# EAGLE design server (EAGLE 9.0.1)
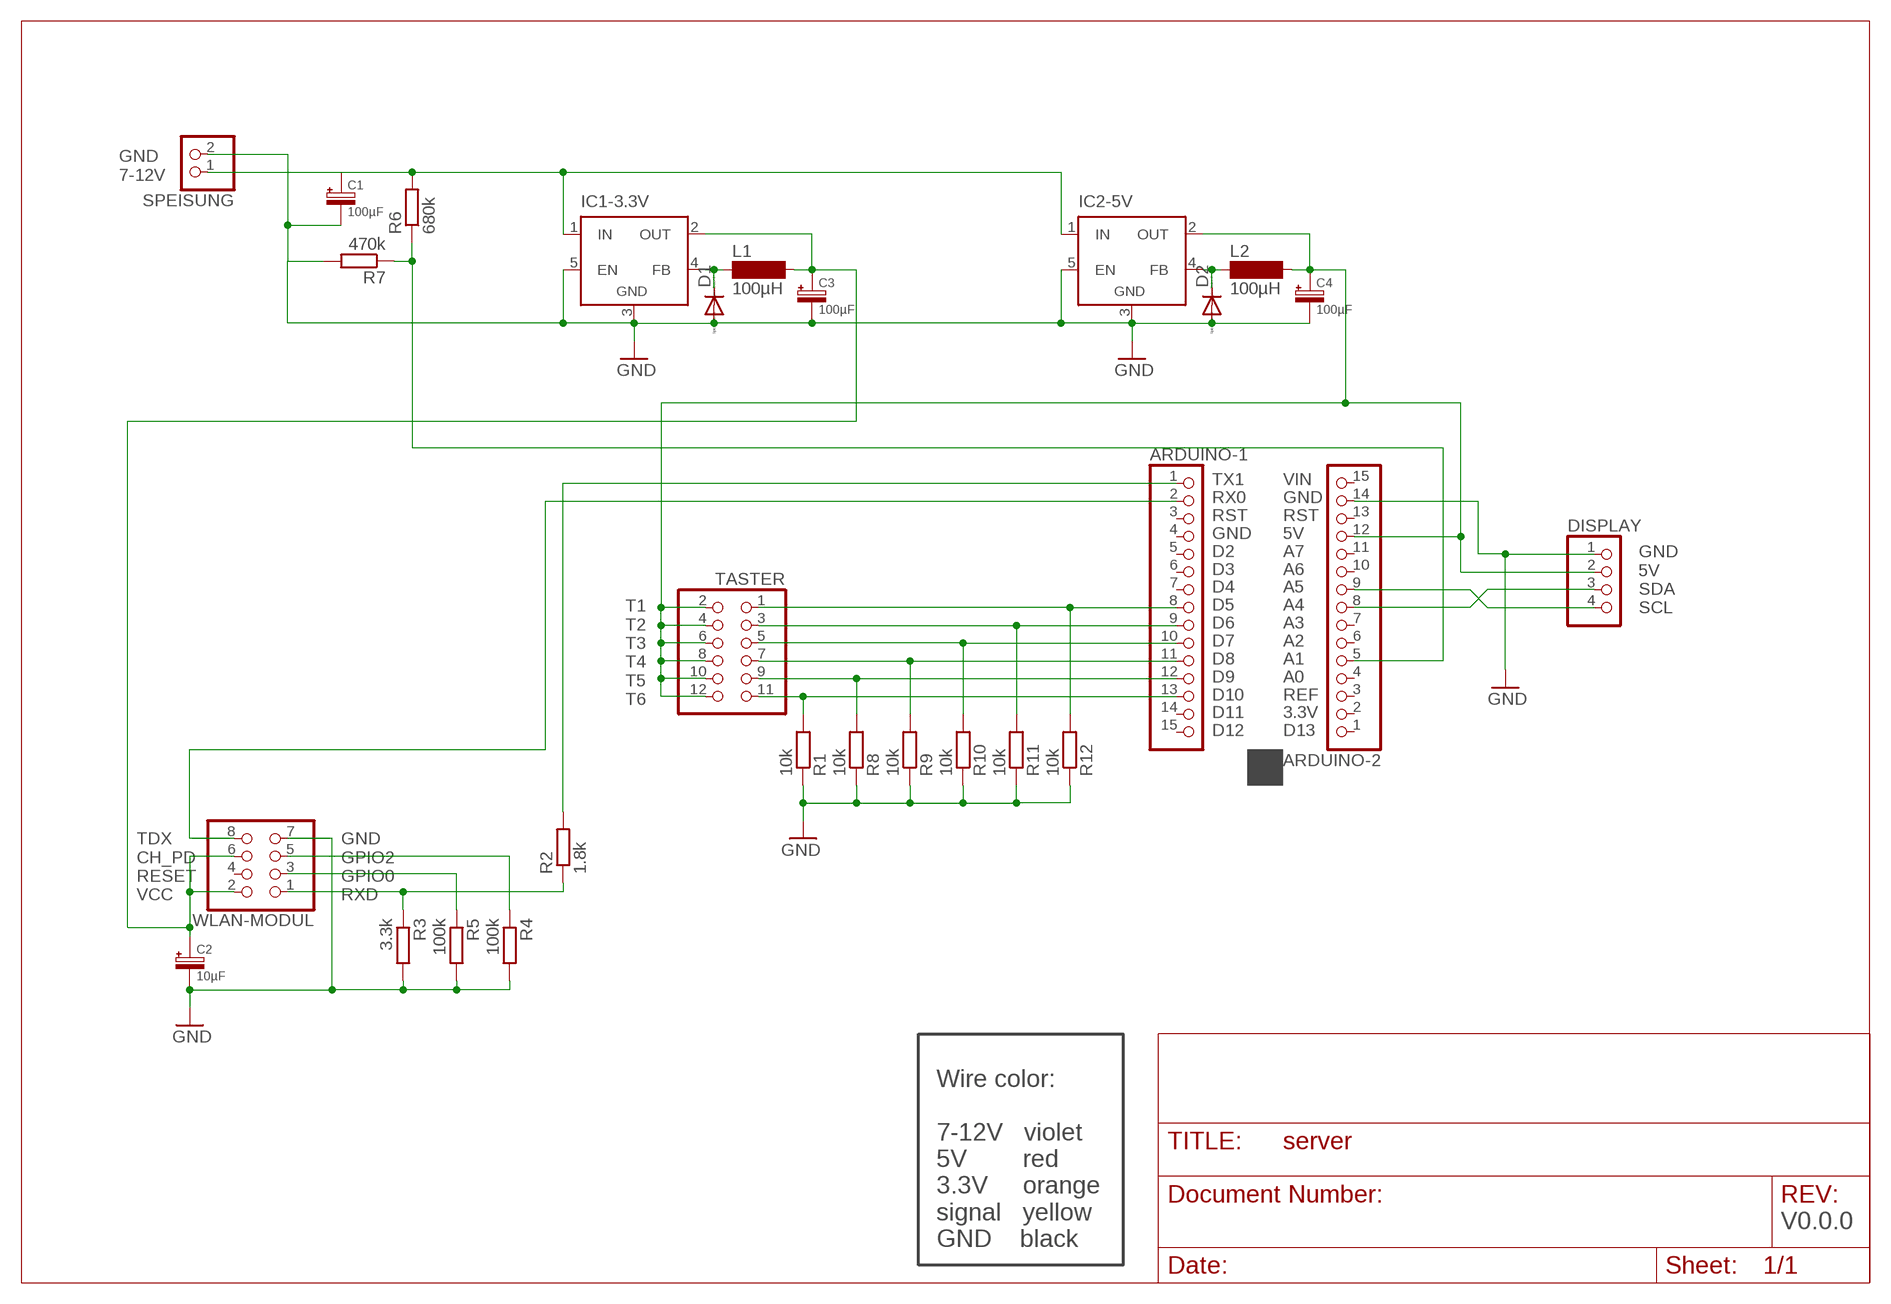
[diagram p0: schematic, sheet 1]

## Parts
ARDUINO-1  PINHD-1X15  [1X15]
ARDUINO-2  PINHD-1X15  [1X15]
C1  100µF  KONDENSATOR_ELEKTROLYT  [KONDENSATOR_ELEKTROLYT]
C2  10µF  KONDENSATOR_ELEKTROLYT  [KONDENSATOR_ELEKTROLYT]
C3  100µF  KONDENSATOR_ELEKTROLYT  [KONDENSATOR_ELEKTROLYT]
C4  100µF  KONDENSATOR_ELEKTROLYT  [KONDENSATOR_ELEKTROLYT]
D1  DIODE-D-2.5  [D-2.5]
D2  DIODE-D-2.5  [D-2.5]
DISPLAY  PINHD-1X4  [1X04]
IC1-3.3V  LM2596TV  [TO220-51]
IC2-5V  LM2596TV  [TO220-51]
L1  100µH  SM-L15A  [SM-L15A]
L2  100µH  SM-L15A  [SM-L15A]
R1  10k  R-EU_0207/15  [0207/15]
R2  1.8k  R-EU_0207/10  [0207/10]
R3  3.3k  R-EU_0207/10  [0207/10]
R4  100k  R-EU_0207/10  [0207/10]
R5  100k  R-EU_0207/10  [0207/10]
R6  680k  R-EU_0204/2V  [0204V]
R7  470k  R-EU_0204/2V  [0204V]
R8  10k  R-EU_0207/12  [0207/12]
R9  10k  R-EU_0207/10  [0207/10]
R10  10k  R-EU_0207/7  [0207/7]
R11  10k  R-EU_0207/5V  [0207/5V]
R12  10k  R-EU_0207/2V  [0207/2V]
SPEISUNG  PINHD-1X2  [1X02]
TASTER  PINHD-2X6  [2X06]
WLAN-MODUL  PINHD-2X4  [2X04]

## Nets
GND: ARDUINO-2.14 C1.P$1 C2.P$1 C3.P$1 C4.P$1 D1.A D2.A DISPLAY.1 IC1-3.3V.3(GND) IC1-3.3V.5(EN) IC2-5V.3(GND) IC2-5V.5(EN) R1.1 R3.2 R4.2 R5.2 R7.2 R8.1 R9.1 R10.1 R11.1 R12.1 SPEISUNG.2 WLAN-MODUL.7
N$1: D1.C IC1-3.3V.4(FB) L1.1
N$2: ARDUINO-1.9 R11.2 TASTER.3
N$3: C1.P$2 IC1-3.3V.1(IN) IC2-5V.1(IN) R6.2 SPEISUNG.1
N$4: C2.P$2 C3.P$2 IC1-3.3V.2(OUT) L1.2 WLAN-MODUL.2 WLAN-MODUL.6
N$5: D2.C IC2-5V.4(FB) L2.1
N$6: ARDUINO-1.13 R1.2 TASTER.11
N$7: ARDUINO-2.5 R6.1 R7.1
N$8: ARDUINO-2.8 DISPLAY.3
N$9: ARDUINO-1.12 R8.2 TASTER.9
N$10: ARDUINO-2.9 DISPLAY.4
N$11: R2.1 R3.1 WLAN-MODUL.1
N$12: R5.1 WLAN-MODUL.3
N$13: R4.1 WLAN-MODUL.5
N$14: ARDUINO-1.1 R2.2
N$15: ARDUINO-1.2 WLAN-MODUL.8
N$16: ARDUINO-1.11 R9.2 TASTER.7
N$17: ARDUINO-1.10 R10.2 TASTER.5
N$18: ARDUINO-2.12 C4.P$2 DISPLAY.2 IC2-5V.2(OUT) L2.2 TASTER.2 TASTER.4 TASTER.6 TASTER.8 TASTER.10 TASTER.12
N$19: ARDUINO-1.8 R12.2 TASTER.1
Unconnected: ARDUINO-1.3 ARDUINO-1.4 ARDUINO-1.5 ARDUINO-1.6 ARDUINO-1.7 ARDUINO-1.14 ARDUINO-1.15 ARDUINO-2.1 ARDUINO-2.2 ARDUINO-2.3 ARDUINO-2.4 ARDUINO-2.6 ARDUINO-2.7 ARDUINO-2.10 ARDUINO-2.11 ARDUINO-2.13 ARDUINO-2.15 WLAN-MODUL.4

## Notes on the sheet
- GND
  7-12V
- GND
  5V
  SDA
  SCL
- T1
  T2
  T3
  T4
  T5
  T6
- TX1
  RX0
  RST
  GND
  D2
  D3
  D4
  D5
  D6
  D7
  D8
  D9
  D10
  D11
  D12
- VIN
  GND
  RST
  5V
  A7
  A6
  A5
  A4
  A3
  A2
  A1
  A0
  REF
  3.3V
  D13
- TDX
  CH_PD
  RESET
  VCC
- GND
  GPIO2
  GPIO0
  RXD
- V0.0.0
- Wire color:
  
  7-12V   violet
  5V        red
  3.3V     orange
  signal   yellow
  GND    black

## Library data of the parts
ARDUINO-1 ARDUINO-2 = pinhead:PINHD-1X15: PIN HEADER
C1-C4 = 0_TEC-1.IPA Sven:KONDENSATOR_ELEKTROLYT
D1 D2 = diode:DIODE-: DIODE
DISPLAY = pinhead:PINHD-1X4: PIN HEADER
IC1-3.3V IC2-5V = linear:LM2596T: STEP-DOWN VOLTAGE REGULATOR
L1 L2 = inductor-neosid:SM-L15: INDUCTOR SMD air coil with pick and place cap; OC_FARNELL: unknown; OC_NEWARK: unknown
R1 R6-R12 = rcl:R-EU_: RESISTOR, European symbol; SPICEPREFIX: R
R2-R5 = rcl:R-EU_: RESISTOR, European symbol
SPEISUNG = pinhead:PINHD-1X2: PIN HEADER
TASTER = pinhead:PINHD-2X6: PIN HEADER
WLAN-MODUL = pinhead:PINHD-2X4: PIN HEADER

## Board
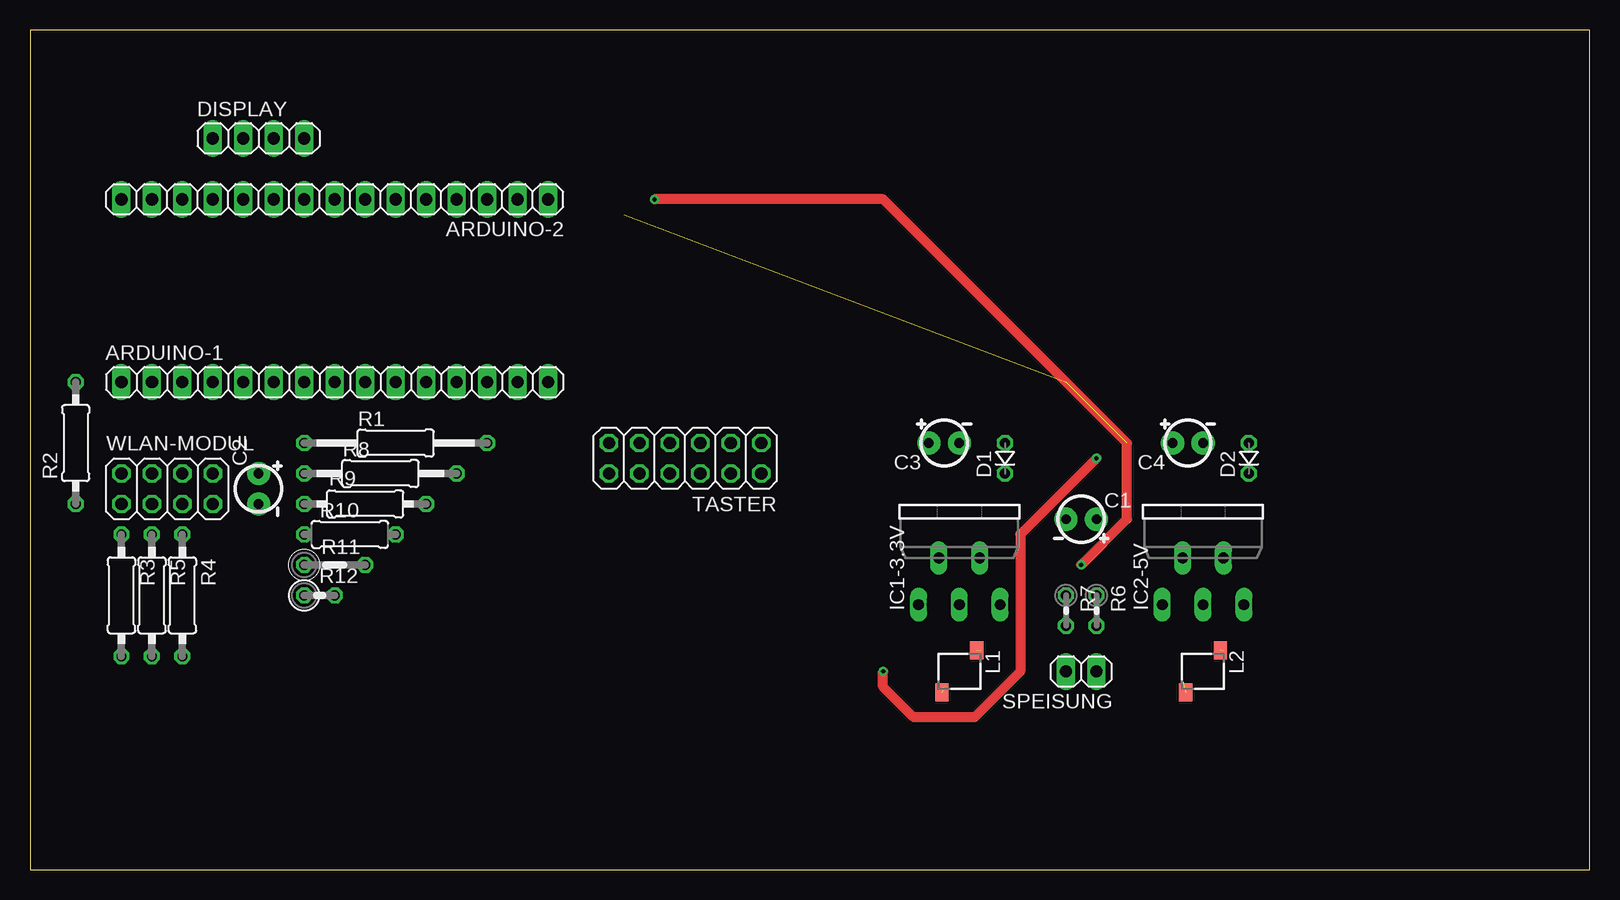
[diagram p1: board, top side]
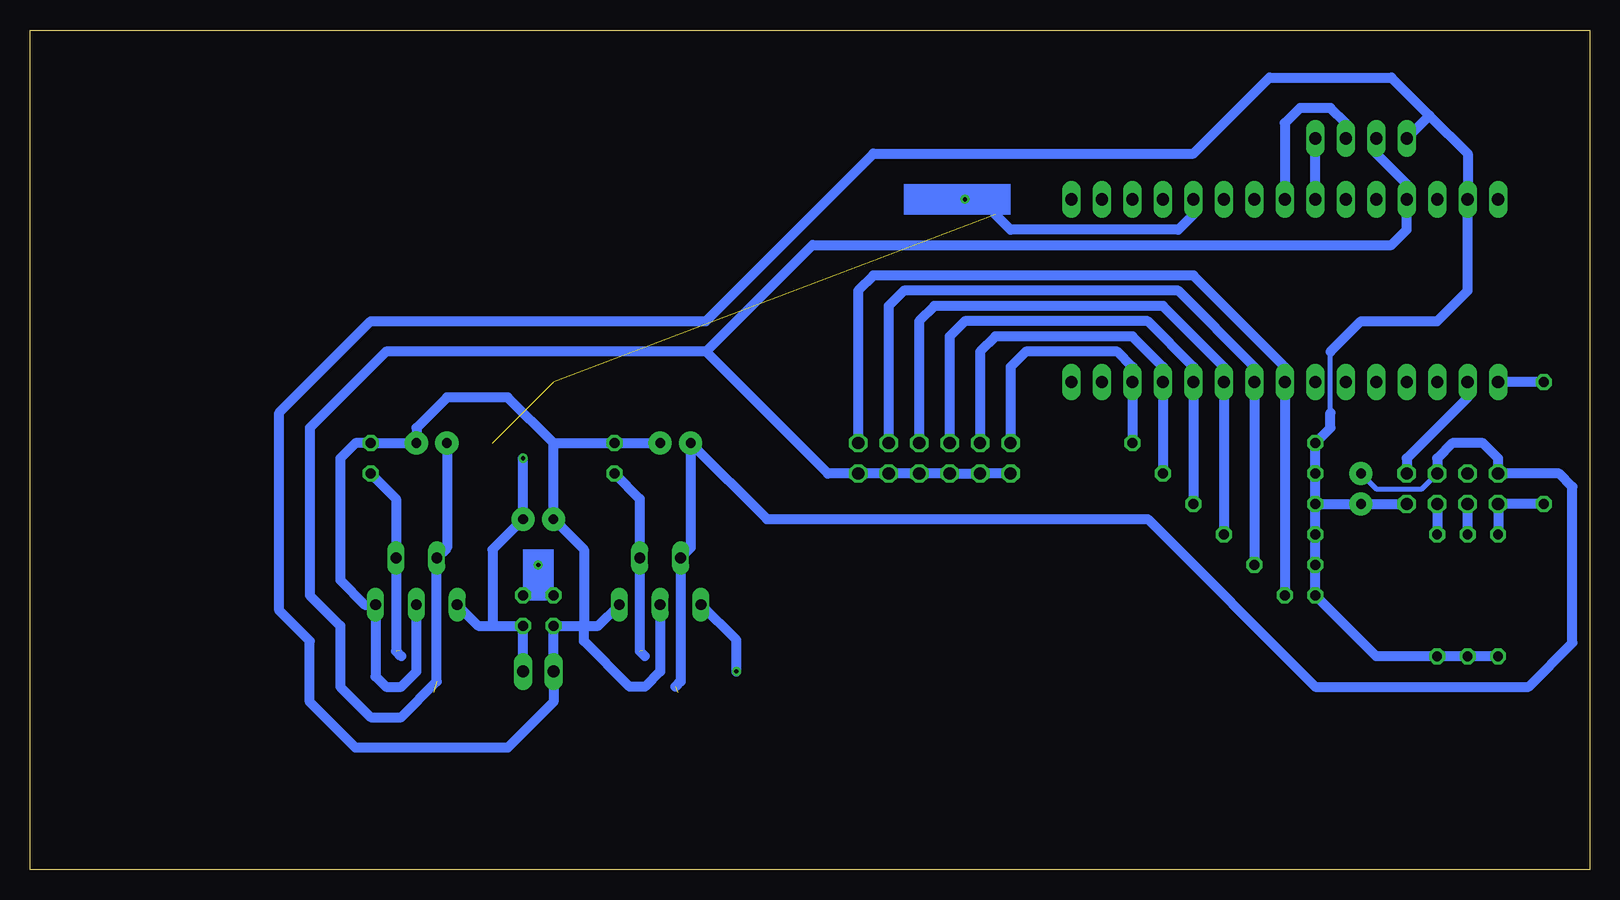
[diagram p2: board, bottom side, seen from below]

Size 130 x 70 mm. Coordinates in mm from the lower left corner, seen from the top.
Outline: 0,0 130,0 130,70 0,70 0,0
Copper layers (1*16): Top 0.035mm / dielectric 1.5mm / Bottom 0.035mm
Design rules "default": minimum track width 6mil, minimum drill 0.35mm, track to track 6mil, track to pad 6mil, pad to pad 6mil, via to via 6mil, smd to smd 6mil, copper to edge 40mil, drill to drill 6mil, minimum pad ring 10mil, minimum via ring 8mil, stop-mask expansion 4mil, vias tented up to drill 0mil, thermal gap 10mil

### Footprints (pad centres in the part's own frame; a part is rotated, then mirrored left to right if it is on the bottom)
1X15 = drill 1.016 long: 1 -17.78,0; 2 -15.24,0; 3 -12.7,0; 4 -10.16,0; 5 -7.62,0; 6 -5.08,0; 7 -2.54,0; 8 0,0; 9 2.54,0; 10 5.08,0; 11 7.62,0; 12 10.16,0; 13 12.7,0; 14 15.24,0; 15 17.78,0
KONDENSATOR_ELEKTROLYT = drill 0.8 pad 1.93: P$1 -1.27,0; P$2 1.27,0
D-2.5 = drill 0.813 octagon: A 1.27,0; C -1.27,0
1X04 = drill 1.016 long: 1 -3.81,0; 2 -1.27,0; 3 1.27,0; 4 3.81,0
TO220-51 = drill 0.9 long: 1 -3.4,-8.4; 2 -1.7,-4.5; 3 0,-8.4; 4 1.7,-4.5; 5 3.4,-8.4
SM-L15A = smd 1.1 x 1.5: 1 -1.45,-1.75; 2 1.45,1.75
0207/15 = drill 0.813 octagon: 1 -7.62,0; 2 7.62,0
0207/10 = drill 0.813 octagon: 1 -5.08,0; 2 5.08,0
0204V = drill 0.813 octagon: 1 -1.27,0; 2 1.27,0
0207/12 = drill 0.813 octagon: 1 -6.35,0; 2 6.35,0
0207/7 = drill 0.813 octagon: 1 -3.81,0; 2 3.81,0
0207/5V = drill 0.813 octagon: 1 -2.54,0; 2 2.54,0
0207/2V = drill 0.813 octagon: 1 -1.27,0; 2 1.27,0
1X02 = drill 1.016 long: 1 -1.27,0; 2 1.27,0
2X06 = drill 1.016 octagon: 1 -6.35,-1.27; 2 -6.35,1.27; 3 -3.81,-1.27; 4 -3.81,1.27; 5 -1.27,-1.27; 6 -1.27,1.27; 7 1.27,-1.27; 8 1.27,1.27; 9 3.81,-1.27; 10 3.81,1.27; 11 6.35,-1.27; 12 6.35,1.27
2X04 = drill 1.016 octagon: 1 -3.81,-1.27; 2 -3.81,1.27; 3 -1.27,-1.27; 4 -1.27,1.27; 5 1.27,-1.27; 6 1.27,1.27; 7 3.81,-1.27; 8 3.81,1.27

### Placement (x,y rotation side)
ARDUINO-1  25.4,40.64 0 top
ARDUINO-2  25.4,55.88 180 top
C1  87.63,29.21 0 top
C2  19.05,31.75 90 top
C3  76.2,35.56 180 top
C4  96.52,35.56 180 top
D1  81.28,34.29 90 top
D2  101.6,34.29 90 top
DISPLAY  19.05,60.96 0 top
IC1-3.3V  77.47,30.48 0 top
IC2-5V  97.79,30.48 0 top
L1  77.47,16.51 180 top
L2  97.79,16.51 180 top
R1  30.48,35.56 0 top
R2  3.81,35.56 90 top
R3  7.62,22.86 270 top
R4  12.7,22.86 270 top
R5  10.16,22.86 270 top
R6  88.9,21.59 270 top
R7  86.36,21.59 270 top
R8  29.21,33.02 0 top
R9  27.94,30.48 0 top
R10  26.67,27.94 0 top
R11  25.4,25.4 0 top
R12  24.13,22.86 0 top
SPEISUNG  87.63,16.51 180 top
TASTER  54.61,34.29 180 top
WLAN-MODUL  11.43,31.75 0 top

### Tracks (layer width: path | path; a pad name or v marks a point on that pad's centre or on a via)
GND
  Bottom 0.406: 21.59,38.1 21.59,43.18
  Bottom 0.813: 83.82,20.32 R7.2 SPEISUNG.2 86.36,13.97 90.17,10.16 102.87,10.16 106.68,13.97 106.68,19.05 109.22,21.59 109.22,38.1 101.6,45.72 73.66,45.72 59.69,59.69 33.02,59.69 26.67,66.04 16.51,66.04 13.34,62.87 | 83.82,20.32 82.63,20.32 IC1-3.3V.5 | 83.82,20.32 83.82,26.67 C1.P$1 86.36,35.56 | C3.P$1 D1.A 86.36,35.56 | IC1-3.3V.3 77.47,16.51 78.74,15.24 80.01,15.24 83.82,19.05 83.82,20.32 | IC2-5V.3 97.79,16.51 99.06,15.24 100.33,15.24 101.19,16.1 IC2-5V.5 102.09,22.08 104.14,24.13 104.14,34.29 102.87,35.56 D2.A C4.P$1 97.79,36.83 95.25,39.37 90.17,39.37 86.36,35.56 | R3.2 R5.2 R4.2 17.78,17.78 R12.1 R11.1 R10.1 R9.1 | R9.1 R8.1 R1.1 21.59,36.83 21.59,38.1 | R9.1 C2.P$1 WLAN-MODUL.7 | 13.34,62.87 10.16,59.69 ARDUINO-2.14 10.16,48.26 12.7,45.72 19.05,45.72 21.59,43.18 | DISPLAY.1 13.34,62.87
N$1  (1 unrouted)
  Bottom 0.813: D1.C 79.17,30.91 IC1-3.3V.4 79.17,18.21 78.74,17.78
N$2
  Bottom 0.813: R11.2 ARDUINO-1.9 27.94,41.91 34.29,48.26 57.15,48.26 58.42,46.99 TASTER.3
N$3  (via drill 0.35)
  Top 0.813: v88.9,34.29 82.55,27.94 82.55,16.51 78.74,12.7 73.66,12.7 71.12,15.24 v71.12,16.51
  Bottom 0.813: SPEISUNG.1 R6.2 91.44,20.32 | IC2-5V.1 92.63,20.32 91.44,20.32 | 91.44,20.32 91.44,26.67 C1.P$2 v88.9,34.29 | v71.12,16.51 71.12,19.13 IC1-3.3V.1
N$4  (1 unrouted)
  Bottom 0.406: C2.P$2 17.78,31.75 13.97,31.75 WLAN-MODUL.6
  Bottom 0.813: 76.2,15.24 75.77,15.67 IC1-3.3V.2 74.93,26.82 C3.P$2 68.58,29.21 36.83,29.21 22.86,15.24 5.08,15.24 1.42,18.9 1.42,31.9 2.54,33.02 WLAN-MODUL.2 7.62,34.29 8.89,35.56 11.43,35.56 12.7,34.29 WLAN-MODUL.6
N$5  (1 unrouted)
  Bottom 0.813: D2.C 99.49,30.91 IC2-5V.4 99.49,18.21 99.06,17.78
N$6
  Bottom 0.813: R1.2 ARDUINO-1.13 38.1,41.91 39.37,43.18 46.99,43.18 48.26,41.91 TASTER.11
N$7  (via drill 0.35)  (2 unrouted)
  Top 0.813: v87.63,25.4 91.44,29.21 91.44,35.56 71.12,55.88 v52.07,55.88
  Bottom 0.813: R6.1 R7.1 87.63,24.13 v87.63,25.4 | ARDUINO-2.5 33.02,54.61 34.29,53.34 48.26,53.34 49.53,54.61
N$8
  Bottom 0.813: DISPLAY.3 20.32,62.23 21.59,63.5 24.13,63.5 25.4,62.23 ARDUINO-2.8
N$9
  Bottom 0.813: R8.2 ARDUINO-1.12 35.56,41.91 38.1,44.45 49.53,44.45 50.8,43.18 TASTER.9
N$10
  Bottom 0.813: ARDUINO-2.9 DISPLAY.4
N$11
  Bottom 0.813: R2.1 WLAN-MODUL.1 R3.1
N$12
  Bottom 0.813: R5.1 WLAN-MODUL.3
N$13
  Bottom 0.813: WLAN-MODUL.5 R4.1
N$14
  Bottom 0.813: R2.2 ARDUINO-1.1
N$15
  Bottom 0.813: ARDUINO-1.2 10.16,39.37 15.24,34.29 WLAN-MODUL.8
N$16
  Bottom 0.813: R9.2 ARDUINO-1.11 33.02,41.91 36.83,45.72 52.07,45.72 53.34,44.45 TASTER.7
N$17
  Bottom 0.813: R10.2 ARDUINO-1.10 30.48,41.91 35.56,46.99 54.61,46.99 55.88,45.72 TASTER.5
N$18  (1 unrouted)
  Bottom 0.813: C4.P$2 95.25,26.82 IC2-5V.2 96.09,15.67 99.06,12.7 101.6,12.7 104.14,15.24 104.14,20.32 106.68,22.86 106.68,36.83 100.33,43.18 73.66,43.18 | TASTER.12 TASTER.10 TASTER.8 TASTER.6 TASTER.4 TASTER.2 63.5,33.02 73.66,43.18 | 73.66,43.18 64.77,52.07 16.51,52.07 15.24,53.34 ARDUINO-2.12 15.24,57.15 17.78,59.69 DISPLAY.2
N$19
  Bottom 0.813: R12.2 ARDUINO-1.8 25.4,41.91 33.02,49.53 59.69,49.53 60.96,48.26 TASTER.1
(copper drawn outside any net)
  shapes: Bottom area x2